# Altium schematic sheet OK6010_DB_ADC.SchDoc
size 260 x 195 mm; PageSetup: Record=PageOptions|CenterHorizontal=True|CenterVertical=True|PrintScale=0.82|XCorrection=1.00|YCorrection=1.00|PrintKind=2|BorderSize=5000000|LeftOffset=0|BottomOffset=0|Orientation=2|PaperLength=1000|PaperWidth=1000|Scale=100|PaperSource=15|PrintQuality=600|MediaType=1|DitherType=10|PaperKind=Letter|PrintScaleMode=1
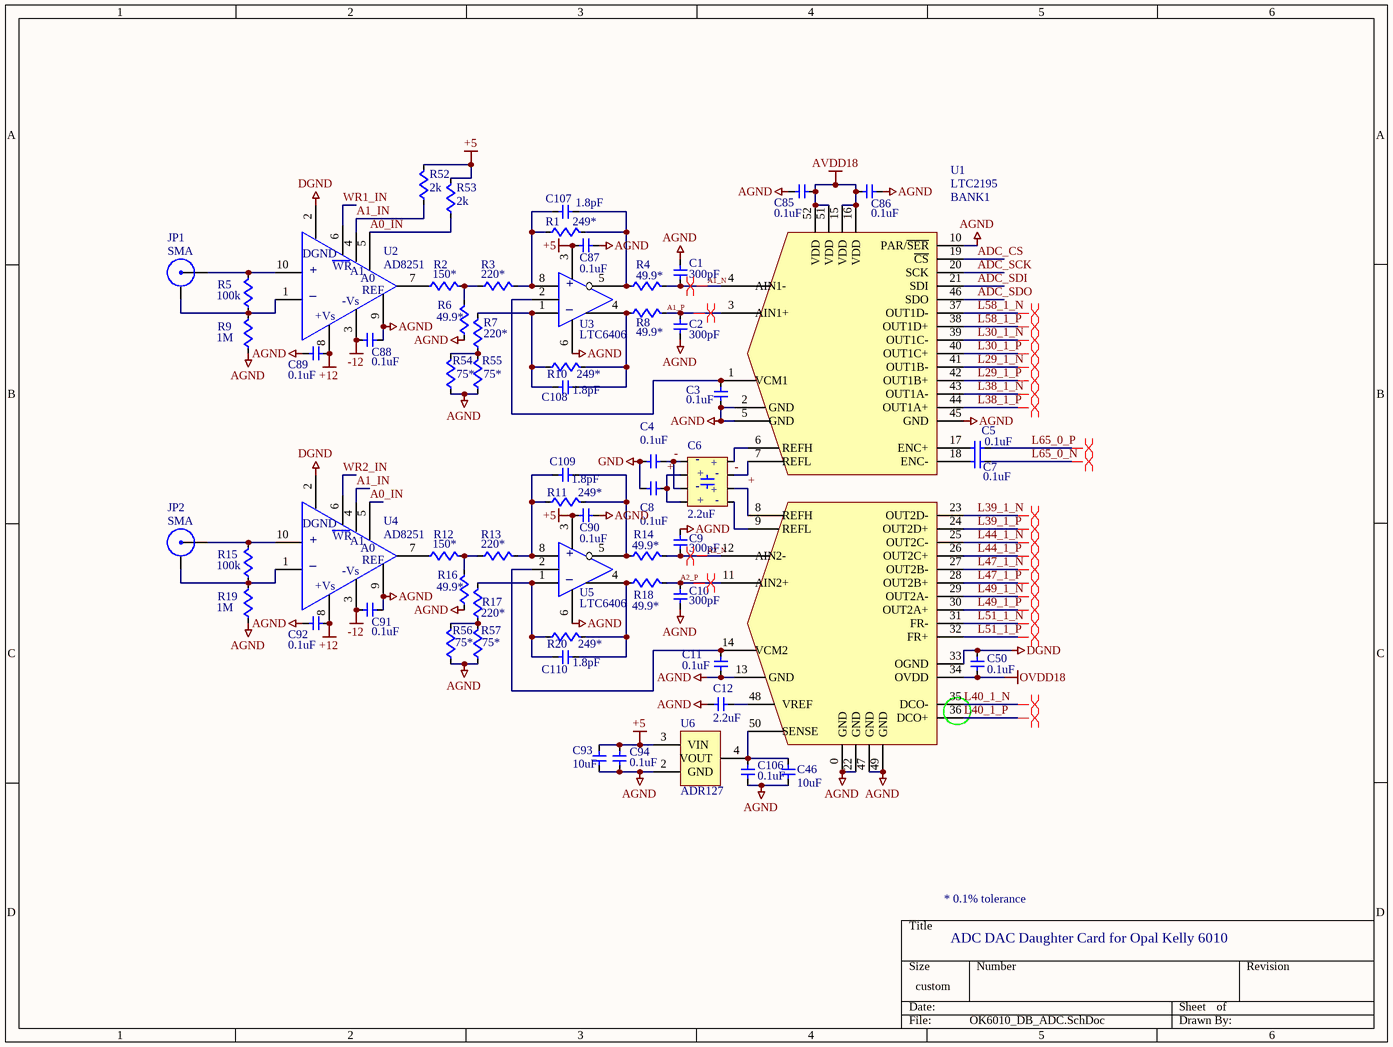
[diagram p0: OK6010_DB_ADC.SchDoc]

## Parts
C1  300pF  [0603w]
C2  300pF  [0603w]
C3  0.1uF  [0603w]
C4  0.1uF  [0603w]
C5  0.1uF  [1206]
C6  2.2uF  [0805 CLL]
C7  0.1uF  [1206]
C8  0.1uF  [0603w]
C9  300pF  [0603w]
C10  300pF  [0603w]
C11  0.1uF  [0603w]
C12  2.2uF  [0603w]
C46  10uF  [0603w]
C50  0.1uF  [0603w]
C85  0.1uF  [0603w]
C86  0.1uF  [0603w]
C87  0.1uF  [0603w]
C88  0.1uF  [0603w]
C89  0.1uF  [0603w]
C90  0.1uF  [0603w]
C91  0.1uF  [0603w]
C92  0.1uF  [0603w]
C93  10uF  [0603w]
C94  0.1uF  [0603w]
C106  0.1uF  [0603w]
C107  1.8pF  [0603w]
C108  1.8pF  [0603w]
C109  1.8pF  [0603w]
C110  1.8pF  [0603w]
JP1  SMA  [sma_pcb_200]
JP2  SMA  [sma_pcb_200]
R1  249*  [0603w]
R2  150*  [0603w]
R3  220*  [0603w]
R4  49.9*  [0603w]
R5  100k  [0603w]
R6  49.9*  [0603w]
R7  220*  [0603w]
R8  49.9*  [0603w]
R9  1M  [0603w]
R10  249*  [0603w]
R11  249*  [0603w]
R12  150*  [0603w]
R13  220*  [0603w]
R14  49.9*  [0603w]
R15  100k  [0603w]
R16  49.9*  [0603w]
R17  220*  [0603w]
R18  49.9*  [0603w]
R19  1M  [0603w]
R20  249*  [0603w]
R52  2k  [0603w]
R53  2k  [0603w]
R54  75*  [0603w]
R55  75*  [0603w]
R56  75*  [0603w]
R57  75*  [0603w]
U1  LTC2195  [UKG - QFN52]
U2  AD8251  [MSOP10sm]
U3  LTC6406  [MSOP08]
U4  AD8251  [MSOP10sm]
U5  LTC6406  [MSOP08]
U6  ADR127  [TSOT-6]

## Nets
+5: C87.1 C90.1 C93.1 C94.2 R52.2 R53.2 U3.3 U5.3 U6.3(VIN)
+12: C89.1 C92.1 U2.8 U4.8
-12: C88.1 C91.1 U2.3 U4.3
AGND: C1.1 C2.2 C3.2 C9.1 C10.2 C11.2 C12.2 C46.2 C85.2 C86.2 C87.2 C88.2 C89.2 C90.2 C91.2 C92.2 C93.2 C94.1 C106.1 R6.1 R9.1 R16.1 R19.1 R54.1 R55.1 R56.1 R57.1 U1.0(GND) U1.2(GND) U1.5(GND) U1.10(PAR/~{SER}) U1.13(GND) U1.22(GND) U1.45(GND) U1.47(GND) U1.49(GND) U2.9 U3.6 U4.9 U5.6 U6.2(GND)
AVDD18: C85.1 C86.1 U1.15(VDD) U1.16(VDD) U1.51(VDD) U1.52(VDD)
DGND: C50.1 U1.33(OGND) U2.2 U4.2
GND: C4.2 C8.2
OVDD18: C50.2 U1.34(OVDD)
+: C6.2 C6.4 C6.6 C8.1 U1.8(REFH)
-: C4.1 C6.1 C6.3 C6.7 U1.7(REFL)
A0_IN: R53.1 U2.5 U4.5
A1_IN: R52.1 U2.4 U4.4
A1_N: C1.2 R4.2 U1.4(AIN1-)
A1_P: C2.1 R8.2 U1.3(AIN1+)
A2_N: C9.2 R14.2 U1.12(AIN2-)
A2_P: C10.1 R18.2 U1.11(AIN2+)
ADC_CS: U1.19(~{CS})
ADC_SCK: U1.20(SCK)
ADC_SDI: U1.21(SDI)
ADC_SDO: U1.46(SDO)
L29_1_N: U1.41(OUT1B-)
L29_1_P: U1.42(OUT1B+)
L30_1_N: U1.39(OUT1C-)
L30_1_P: U1.40(OUT1C+)
L38_1_N: U1.43(OUT1A-)
L38_1_P: U1.44(OUT1A+)
L39_1_N: U1.23(OUT2D-)
L39_1_P: U1.24(OUT2D+)
L40_1_N: U1.35(DCO-)
L40_1_P: U1.36(DCO+)
L44_1_N: U1.25(OUT2C-)
L44_1_P: U1.26(OUT2C+)
L47_1_N: U1.27(OUT2B-)
L47_1_P: U1.28(OUT2B+)
L49_1_N: U1.29(OUT2A-)
L49_1_P: U1.30(OUT2A+)
L51_1_N: U1.31(FR-)
L51_1_P: U1.32(FR+)
L58_1_N: U1.37(OUT1D-)
L58_1_P: U1.38(OUT1D+)
L65_0_N: C7.2
L65_0_P: C5.2
WR1_IN: U2.6
WR2_IN: U4.6
NetC3_1: C3.1 U1.1(VCM1) U3.2
NetC5_1: C5.1 U1.17(ENC+)
NetC6_5: C6.5 U1.9(REFL)
NetC6_8: C6.8 U1.6(REFH)
NetC7_1: C7.1 U1.18(ENC-)
NetC11_1: C11.1 U1.14(VCM2) U5.2
NetC12_1: C12.1 U1.48(VREF)
NetC46_1: C46.1 C106.2 U1.50(SENSE) U6.4(VOUT)
NetC107_1: C107.1 R1.1 R3.2 U3.8
NetC107_2: C107.2 R1.2 R4.1 U3.5
NetC108_1: C108.1 R7.2 R10.1 U3.1
NetC108_2: C108.2 R8.1 R10.2 U3.4
NetC109_1: C109.1 R11.1 R13.2 U5.8
NetC109_2: C109.2 R11.2 R14.1 U5.5
NetC110_1: C110.1 R17.2 R20.1 U5.1
NetC110_2: C110.2 R18.1 R20.2 U5.4
NetJP1_0: JP1.0(ground) R5.1 R9.2 U2.1
NetJP1_1: JP1.1(signal) R5.2 U2.10
NetJP2_0: JP2.0(ground) R15.1 R19.2 U4.1
NetJP2_1: JP2.1(signal) R15.2 U4.10
NetR2_1: R2.1 U2.7
NetR2_2: R2.2 R3.1 R6.2
NetR7_1: R7.1 R54.2 R55.2
NetR12_1: R12.1 U4.7
NetR12_2: R12.2 R13.1 R16.2
NetR17_1: R17.1 R56.2 R57.2

Not connected (* = marked no-connect by the designer): U6 1(NC) 5(NC) 6(NC)

## Layout directives
differential pair: A1_N, A1_P, A2_N, A2_P, L29_1_N, L29_1_P, L30_1_N, L30_1_P, L38_1_N, L38_1_P, L39_1_N, L39_1_P, L40_1_N, L40_1_P, L44_1_N, L44_1_P, L47_1_N, L47_1_P, L49_1_N, L49_1_P, L51_1_N, L51_1_P, L58_1_N, L58_1_P, L65_0_N, L65_0_P

## Notes on the sheet
- (near U1) BANK1
- * 0.1% tolerance
- ADC DAC Daughter Card for Opal Kelly 6010
- (in symbol AD8139) +; _
- (in symbol AD8251) DGND; WR; +; A1; A0; _; REF; -Vs; +Vs
- (in symbol CAP_SM Interdigitated) +

## Library data of the parts
C1 C2 C9 C10 C107-C110 = CAP_SM_1: capacitor; Supplier 1: Digi-Key
  C1 C2 C9 C10: Supplier Part Number 1: 490-1438-1-ND
  C107-C110: Supplier Part Number 1: 712-1328-1-ND
C3 C4 C8 C11 C50 C85 C86 C88-C92 C94 C106 = CAP_SM_1: capacitor; Manufacturer: Kemet; Manufacturer Part Number: C0603C104K3RACTU; Capacitance: 0.1µF; Temperature Coefficient: X7R; Tolerance: ±10%; Voltage - Rated: 25V; Applications: General Purpose; Category: Capacitors; ComponentLink1Description: http://www.kemet.com/datasheets&C0603C104K3RACTU; ComponentLink1URL: http://www.kemet.com/datasheets&C0603C104K3RACTU; Features: -; Lead Spacing: -; Lead Style: -; Mounting Type: Surface Mount, MLCC; Operating Temperature: -55°C ~ 125°C; Package / Case: 0603 (1608 Metric); Packaging: Cut Tape (CT); Pricing 1: 10=0.075, 100=0.027, 250=0.01952, 500=0.0144, 1000=0.00975 (USD); Ratings: -; RoHS: RoHS Compliant; Size / Dimension: 0.063" L x 0.031" W (1.60mm x 0.80mm); Stock 1: 1185883; Supplier 1: Digi-Key; Supplier Part Number 1: 399-1281-1-ND; Thickness: 0.034" (0.87mm)
C5 C7 = CAP_SM_1: capacitor; Manufacturer: Murata Electronics North America; Manufacturer Part Number: GRM31C5C1E104JA01L; Description: CAP CER .1UF 25V 5% C0G 1206; Capacitance: 0.1µF; Voltage - Rated: 25V; Tolerance: ±5%; Temperature Coefficient: C0G, NP0; Supplier 1: Digi-Key; Supplier Part Number 1: 490-1767-1-ND; RoHS: RoHS Compliant; Category: Capacitors; Stock 1: 374793; Pricing 1: 1=0.57, 10=0.48, 50=0.3436, 100=0.3007, 250=0.23628, 500=0.2148, 1000=0.17184 (USD); Mounting Type: Surface Mount, MLCC; Operating Temperature: -55°C ~ 125°C; Applications: General Purpose; Ratings: -; Package / Case: 1206 (3216 Metric); Size / Dimension: 0.126" L x 0.063" W (3.20mm x 1.60mm); Height: -; Thickness: 0.071" (1.80mm); Lead Spacing: -; Features: -; Packaging: Cut Tape (CT); Lead Style: -; ComponentLink1URL: http://search.murata.co.jp/Ceramy/image/img/PDF/ENG/GRM31C5C1E104JA01.pdf; ComponentLink1Description: http://search.murata.co.jp/Ceramy/image/img/PDF/ENG/GRM31C5C1E104JA01.pdf
C6 = CAP_SM Interdigitated: INTERDIGITATED capacitor; Manufacturer: TDK Corporation; Manufacturer Part Number: CLLE1AX7S0G225M/0.95; Description: CAP LOW ESL 2.2UF 4V X7S 0805; Capacitance: 2.2µF; Voltage - Rated: 4V; Tolerance: ±20%; Temperature Coefficient: X7S; Supplier 1: Digi-Key; Supplier Part Number 1: 445-3406-1-ND; RoHS: RoHS Compliant; Category: Capacitors; Stock 1: 11249; Pricing 1: 1=0.68, 10=0.54, 100=0.325, 250=0.24376, 500=0.208, 1000=0.1625 (USD); Mounting Type: Surface Mount, MLCC; Operating Temperature: -55°C ~ 125°C; Applications: General Purpose; Ratings: -; Package / Case: 0805 (2012 Metric); Size / Dimension: 0.079" L x 0.049" W (2.00mm x 1.25mm); Height: -; Thickness: 0.037" (0.95mm); Lead Spacing: -; Features: Low ESL (Multi-Terminal); Packaging: Cut Tape (CT); Lead Style: -; ComponentLink1URL: http://www.tdk.com/pdf/uli_A11.pdf; ComponentLink1Description: http://www.tdk.com/pdf/uli_A11.pdf
C12 = CAP_SM_1: capacitor; Manufacturer: AVX Corporation; Manufacturer Part Number: 06036C225KAT2A; Description: CAP CER 2.2UF 6.3V X7R 10% 0603; Capacitance: 2.2µF; Voltage - Rated: 6.3V; Tolerance: ±10%; Temperature Coefficient: X7R; Supplier 1: Digi-Key; Supplier Part Number 1: 478-5316-1-ND; RoHS: RoHS Compliant; Category: Capacitors; Stock 1: 284343; Pricing 1: 10=0.209, 100=0.1235, 500=0.07126, 1000=0.0494 (USD); Mounting Type: Surface Mount, MLCC; Operating Temperature: -55°C ~ 125°C; Applications: General Purpose; Ratings: -; Package / Case: 0603 (1608 Metric); Size / Dimension: 0.063" L x 0.032" W (1.60mm x 0.81mm); Height: -; Thickness: 0.035" (0.90mm); Lead Spacing: -; Features: -; Packaging: Cut Tape (CT); Lead Style: -; ComponentLink1URL: http://www.avx.com/docs/Catalogs/cx7r.pdf; ComponentLink1Description: http://www.avx.com/docs/Catalogs/cx7r.pdf
C46 C93 = CAP_SM_1: capacitor; Manufacturer: Murata Electronics North America; Manufacturer Part Number: GRM188R60J106ME47D; Description: CAP CER 10UF 6.3V X5R 0603; Capacitance: 10µF; Voltage - Rated: 6.3V; Tolerance: ±20%; Temperature Coefficient: X5R; Supplier 1: Digi-Key; Supplier Part Number 1: 490-3896-1-ND; RoHS: RoHS Compliant; Category: Capacitors; Stock 1: 1274844; Pricing 1: 1=0.47, 10=0.369, 50=0.2428, 100=0.1926, 250=0.14236, 500=0.11056, 1000=0.0871 (USD); Mounting Type: Surface Mount, MLCC; Operating Temperature: -55°C ~ 85°C; Applications: General Purpose; Ratings: -; Package / Case: 0603 (1608 Metric); Size / Dimension: 0.063" L x 0.031" W (1.60mm x 0.80mm); Height: -; Thickness: 0.035" (0.90mm); Lead Spacing: -; Features: -; Packaging: Cut Tape (CT); Lead Style: -; ComponentLink1URL: http://search.murata.co.jp/Ceramy/image/img/PDF/ENG/GRM188R60J106ME47.pdf; ComponentLink1Description: http://search.murata.co.jp/Ceramy/image/img/PDF/ENG/GRM188R60J106ME47.pdf
C87 = CAP_SM_1: capacitor; Manufacturer: Kemet; Manufacturer Part Number: C0603C104K3RACTU; Description: CAP .1UF 25V CERAMIC X7R 0603; Capacitance: 0.1µF; Voltage - Rated: 25V; Tolerance: ±10%; Temperature Coefficient: X7R; Supplier 1: Digi-Key; Supplier Part Number 1: 399-1281-1-ND; RoHS: RoHS Compliant; Category: Capacitors; Stock 1: 1185883; Pricing 1: 10=0.075, 100=0.027, 250=0.01952, 500=0.0144, 1000=0.00975 (USD); Mounting Type: Surface Mount, MLCC; Operating Temperature: -55°C ~ 125°C; Applications: General Purpose; Ratings: -; Package / Case: 0603 (1608 Metric); Size / Dimension: 0.063" L x 0.031" W (1.60mm x 0.80mm); Height: -; Thickness: 0.034" (0.87mm); Lead Spacing: -; Features: -; Packaging: Cut Tape (CT); Lead Style: -; ComponentLink1URL: http://www.kemet.com/datasheets&C0603C104K3RACTU; ComponentLink1Description: http://www.kemet.com/datasheets&C0603C104K3RACTU
JP1 JP2 = SMA_EDGE: sma connector; Manufacturer: TE Connectivity; Manufacturer Part Number: 5-1814832-1; Connector Type: Jack, Female Sockets; Contact Termination: Solder; Frequency - Max: 3GHz; Impedance: 50 Ohm; Cable Group: -; Category: Connectors, Interconnects; Color: -; ComponentLink1Description: http://documents.tycoelectronics.com/commerce/DocumentDelivery/DDEController?Action=srchrtrv&DocNm=1814832&DocType=CD&DocLang=EN; ComponentLink1URL: http://documents.tycoelectronics.com/commerce/DocumentDelivery/DDEController?Action=srchrtrv&DocNm=1814832&DocType=CD&DocLang=EN; Connector Style: SMA; Fastening Type: Threaded; Features: -; Mounting Type: Through Hole; Packaging: Bulk; Pricing 1: 1=2.7, 25=2.322, 50=2.052, 100=1.836, 250=1.62, 500=1.4364 (USD); RoHS: RoHS Compliant; Stock 1: 22563; Supplier 1: Digi-Key; Supplier Part Number 1: A97594-ND
R1-R3 R7 R10-R13 R17 R20 = RES_SM: resistor; Supplier 1: Digi-Key
  R1 R10 R11 R20: Supplier Part Number 1: RNCS0603BKE249RCT-ND
  R2 R12: Supplier Part Number 1: RNCS0603BKE150RCT-ND
  R3 R7 R13 R17: Supplier Part Number 1: RG16P220BCT-ND
R4 R6 R8 R14 R16 R18 = RES_SM: resistor; Manufacturer: Stackpole Electronics Inc; Manufacturer Part Number: RNCS0603BKE49R9; Description: RES 1.00M OHM 1/10W 1% 0603 SMD; Resistance (Ohms): 49.9; Power (Watts): 0.063W, 1/16W; Temperature Coefficient: ±25ppm/°C; Tolerance: ±0.1%; Supplier 1: Digi-Key; Supplier Part Number 1: RNCS0603BKE49R9CT-ND; RoHS: RoHS Compliant; Category: Resistors; Stock 1: 13782; Pricing 1: 1=0.7, 10=0.475, 50=0.2876, 100=0.2375, 250=0.18752, 500=0.16 (USD); Composition: Thin Film; Features: Anti-Corrosive, Moisture Resistant; Size / Dimension: 0.061" L x 0.031" W (1.55mm x 0.80mm); Height: 0.018" (0.45mm); Number of Terminations: 2; Packaging: Cut Tape (CT); Package / Case: 0603 (1608 Metric); ComponentLink1URL: http://www.seielect.com/Catalog/SEI-rncs.pdf; ComponentLink1Description: http://www.seielect.com/Catalog/SEI-rncs.pdf
R5 R15 = RES_SM: resistor; Manufacturer: Yageo; Manufacturer Part Number: RC0603FR-07100KL; Description: RES 100K OHM 1/10W 1% 0603 SMD; Power (Watts): 0.1W, 1/10W; Temperature Coefficient: ±100ppm/°C; Tolerance: ±1%; Supplier 1: Digi-Key; Supplier Part Number 1: 311-100KHRCT-ND; RoHS: RoHS Compliant; Category: Resistors; Stock 1: 3397757; Pricing 1: 10=0.014, 50=0.0104, 100=0.0079, 250=0.00584, 500=0.00432, 1000=0.00288 (USD); Resistance (Ohms): 100K; Composition: Thick Film; Features: -; Size / Dimension: 0.063" L x 0.031" W (1.60mm x 0.80mm); Height: 0.018" (0.45mm); Number of Terminations: 2; Packaging: Cut Tape (CT); Package / Case: 0603 (1608 Metric); ComponentLink1URL: http://www.yageo.com/documents/recent/PYu-RC0603_51_RoHS_L_4.pdf; ComponentLink1Description: http://www.yageo.com/documents/recent/PYu-RC0603_51_RoHS_L_4.pdf
R9 R19 = RES_SM: resistor; Manufacturer: Yageo; Manufacturer Part Number: RC0603FR-071ML; Description: RES 1.00M OHM 1/10W 1% 0603 SMD; Power (Watts): 0.1W, 1/10W; Temperature Coefficient: ±100ppm/°C; Tolerance: ±1%; Supplier 1: Digi-Key; Supplier Part Number 1: 311-1.00MHRCT-ND; RoHS: RoHS Compliant; Category: Resistors; Stock 1: 1849601; Pricing 1: 10=0.014, 50=0.0104, 100=0.0079, 250=0.00584, 500=0.00432, 1000=0.00288 (USD); Resistance (Ohms): 1M; Composition: Thick Film; Features: -; Size / Dimension: 0.063" L x 0.031" W (1.60mm x 0.80mm); Height: 0.018" (0.45mm); Number of Terminations: 2; Packaging: Cut Tape (CT); Package / Case: 0603 (1608 Metric); ComponentLink1URL: http://www.yageo.com/documents/recent/PYu-RC0603_51_RoHS_L_4.pdf; ComponentLink1Description: http://www.yageo.com/documents/recent/PYu-RC0603_51_RoHS_L_4.pdf
R52 R53 = RES_SM: resistor; Manufacturer: Yageo; Manufacturer Part Number: RC0603FR-072KL; Description: RES 2.00K OHM 1/10W 1% 0603 SMD; Power (Watts): 0.1W, 1/10W; Temperature Coefficient: ±100ppm/°C; Tolerance: ±1%; Supplier 1: Digi-Key; Supplier Part Number 1: 311-2.00KHRCT-ND; RoHS: RoHS Compliant; Category: Resistors; Stock 1: 1136096; Pricing 1: 10=0.014, 50=0.0104, 100=0.0079, 250=0.00584, 500=0.00432, 1000=0.00288 (USD); Resistance (Ohms): 2K; Composition: Thick Film; Features: -; Size / Dimension: 0.063" L x 0.031" W (1.60mm x 0.80mm); Height: 0.018" (0.45mm); Number of Terminations: 2; Packaging: Cut Tape (CT); Package / Case: 0603 (1608 Metric); ComponentLink1URL: http://www.yageo.com/documents/recent/PYu-RC0603_51_RoHS_L_4.pdf; ComponentLink1Description: http://www.yageo.com/documents/recent/PYu-RC0603_51_RoHS_L_4.pdf
R54-R57 = RES_SM: resistor; Manufacturer: Stackpole Electronics Inc; Manufacturer Part Number: RNCS0603BKE75R0; Description: RES 1/16W 75 OHM 0.1% 0603; Resistance (Ohms): 75; Power (Watts): 0.063W, 1/16W; Temperature Coefficient: ±25ppm/°C; Tolerance: ±0.1%; Supplier 1: Digi-Key; Supplier Part Number 1: RNCS0603BKE75R0CT-ND; RoHS: RoHS Compliant; Category: Resistors; Stock 1: 2583; Pricing 1: 1=0.7, 10=0.475, 50=0.2876, 100=0.2375, 250=0.18752, 500=0.16 (USD); Composition: Thin Film; Features: Anti-Corrosive, Moisture Resistant; Size / Dimension: 0.061" L x 0.031" W (1.55mm x 0.80mm); Height: 0.018" (0.45mm); Number of Terminations: 2; Packaging: Cut Tape (CT); Package / Case: 0603 (1608 Metric); ComponentLink1URL: http://www.seielect.com/Catalog/SEI-rncs.pdf; ComponentLink1Description: http://www.seielect.com/Catalog/SEI-rncs.pdf
U1 = LTC2195: 16 bit, low power, dual ADC; Supplier 1: Digi-Key; Supplier Part Number 1: LTC2195CUKG#PBF-ND
U2 = AD8251: Programmable Gain Instumentation Amp; Supplier 1: Digi-Key; Supplier Part Number 1: AD8251ARMZ-ND
U3 U5 = AD8139: Differential ADC Driver; Supplier 1: Digi-Key; Supplier Part Number 1: LTC6406CMS8E#PBF-ND
U4 = AD8251: IC AMP INST ICMOS LDRIFT 10MSOP; Supplier 1: Digi-Key; Supplier Part Number 1: AD8251ARMZ-ND
U6 = ADR12x: Voltage Reference; Manufacturer: Analog Devices Inc; Manufacturer Part Number: ADR127AUJZ-REEL7; Description: IC V-REF PREC 1.25V TSOT-23-6; Reference Type: Series, Precision; Voltage - Output: 1.25V; Tolerance: ±0.24%; Temperature Coefficient: 25ppm/°C; Voltage - Input: 2.7 V ~ 18 V; Number of Channels: 1; Current - Quiescent: 95µA; Current - Output: 5mA; Supplier 1: Digi-Key; Supplier Part Number 1: ADR127AUJZ-REEL7CT-ND; RoHS: RoHS Compliant; Category: Integrated Circuits (ICs); Stock 1: 17098; Pricing 1: 1=3.22, 25=2.484, 100=2.254, 250=2.024, 500=1.748 (USD); Current - Cathode: -; Operating Temperature: -40°C ~ 125°C; Mounting Type: Surface Mount; Package / Case: TSOT-23-6, TSOT-6; Supplier Device Package: TSOT-6; Packaging: Cut Tape (CT); ComponentLink1URL: http://www.analog.com/static/imported-files/Data_Sheets/ADR121_125_127.pdf; ComponentLink1Description: http://www.analog.com/static/imported-files/Data_Sheets/ADR121_125_127.pdf